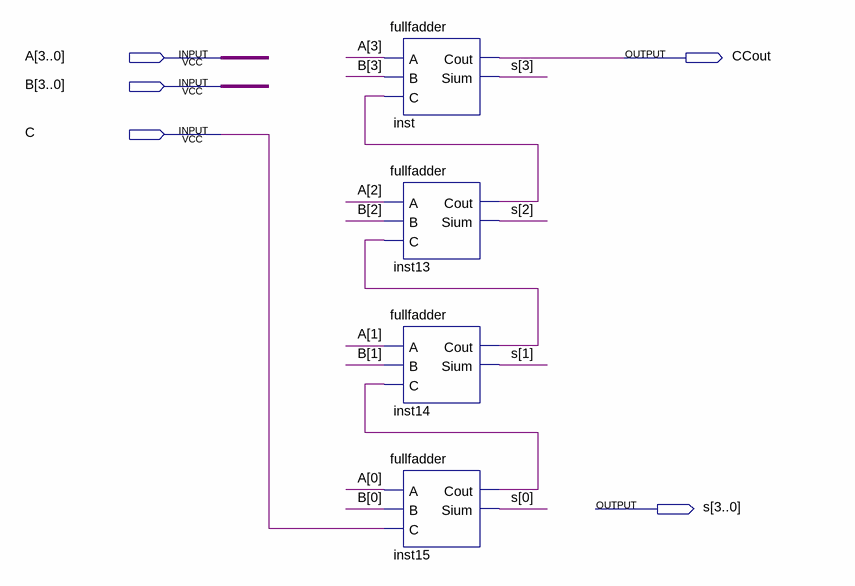
[diagram p0: schematic sheet]
// Quartus schematic fullfullplus.bdf as structural Verilog: 4 symbols, 5 pins
module fullfullplus (
  input  [3:0] A,
  input  [3:0] B,
  input  C,
  output CCout,
  output [3:0] s
);

  wire inst13_cout, inst14_cout, inst15_cout;

  fullfadder inst (.A(A[3]), .B(B[3]), .C(inst13_cout), .Cout(CCout), .Sium(s[3]));
  fullfadder inst13 (.A(A[2]), .B(B[2]), .C(inst14_cout), .Cout(inst13_cout), .Sium(s[2]));
  fullfadder inst14 (.A(A[1]), .B(B[1]), .C(inst15_cout), .Cout(inst14_cout), .Sium(s[1]));
  fullfadder inst15 (.A(A[0]), .B(B[0]), .C(C), .Cout(inst15_cout), .Sium(s[0]));
endmodule
